# Altium schematic sheet Control.SchDoc
size A4
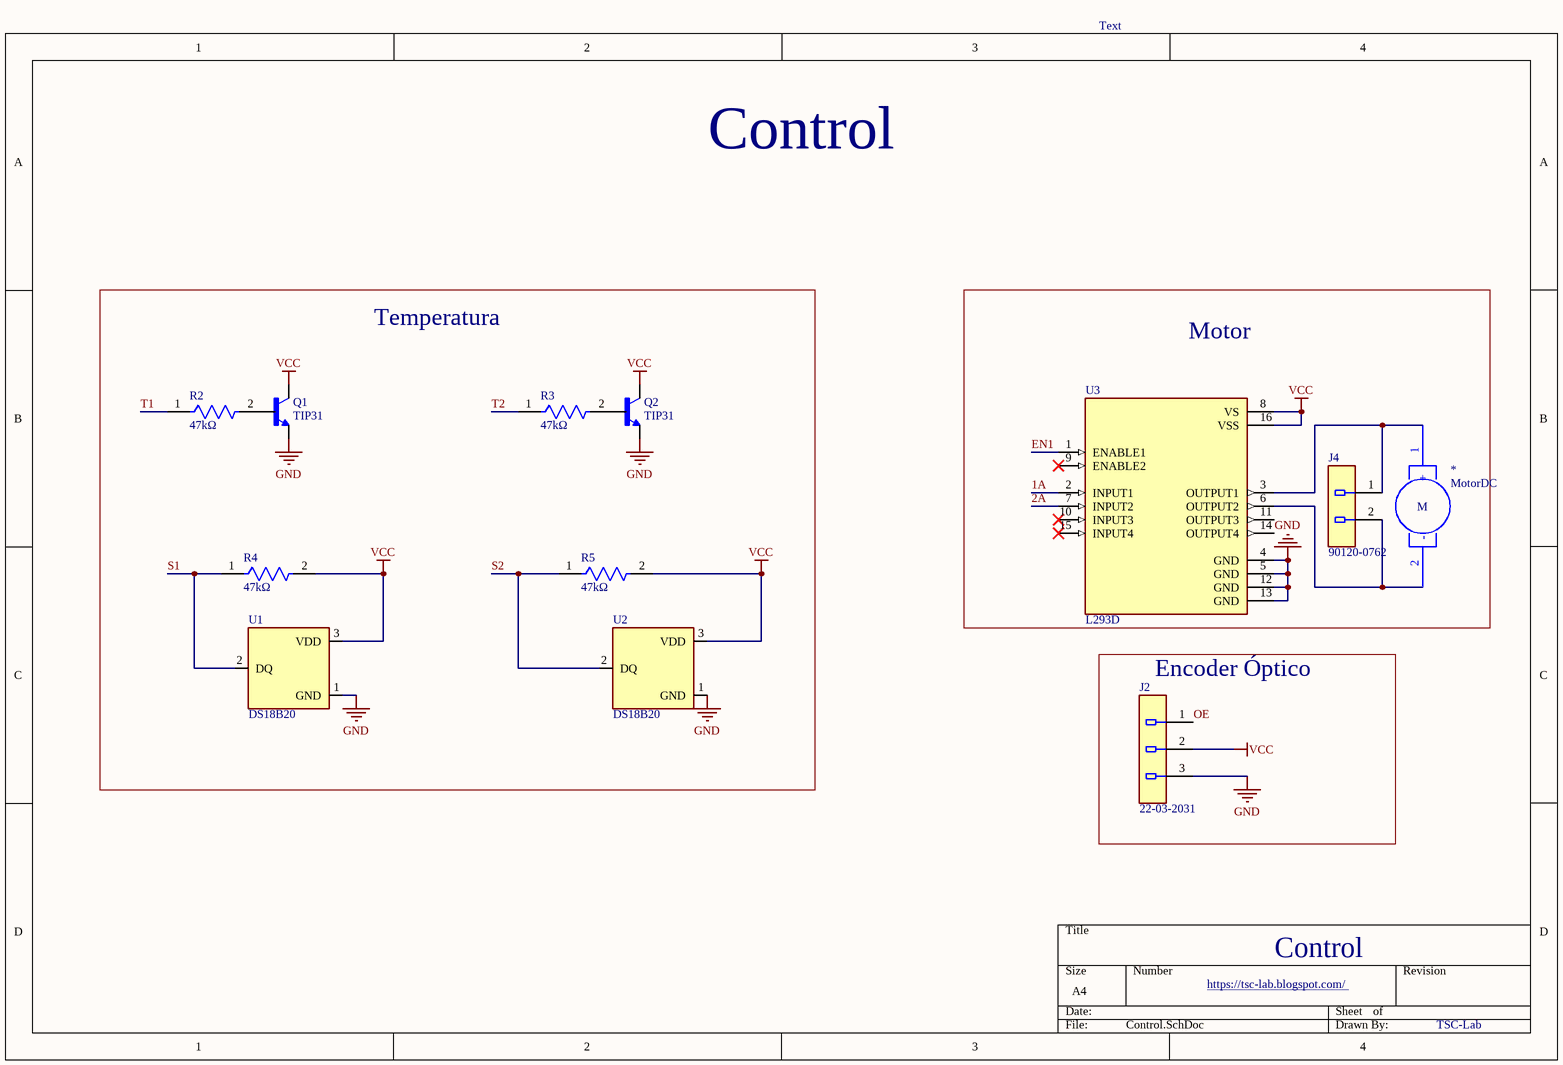
[diagram p0: Control.SchDoc]

## Parts
*  MotorDC  [PCBComponent_1]
J2  Part Number: 22-03-2031  [Molex_SD-4030-0001_0]  (hidden comment: Conn_Molex_22-03-2031_eec)
J4  Part Number: 90120-0762  [Molex_90120-0762_0]  (hidden comment: Conn_Molex_90120-0762_eec)
Q1  TIP31  [TO254P1060X482X2222-3]
Q2  TIP31  [TO254P1060X482X2222-3]
R2  Resistance: 47kΩ  [Vishay_SFR2500002200FR500_0]  (hidden comment: Res_Vishay_SFR2500002200FR500_eec)
R3  Resistance: 47kΩ  [Vishay_SFR2500002200FR500_0]  (hidden comment: Res_Vishay_SFR2500002200FR500_eec)
R4  Resistance: 47kΩ  [Vishay_SFR2500002200FR500_0]  (hidden comment: Res_Vishay_SFR2500002200FR500_eec)
R5  Resistance: 47kΩ  [Vishay_SFR2500002200FR500_0]  (hidden comment: Res_Vishay_SFR2500002200FR500_eec)
U1  DS18B20  [TO-92-TO92127P495H2044-3]
U2  DS18B20  [TO-92-TO92127P495H2044-3]
U3  L293D  [DIP880W50P254L2000H510Q16]

## Blocks framed on the sheet
Temperatura: Q1 Q2 R2-R5 U1 U2
Motor: * J4 U3
Encoder Óptico: J2

## Nets
GND: J2.3 Q1.3(E) Q2.3(E) U1.1(GND) U2.1(GND) U3.4(GND) U3.5(GND) U3.12(GND) U3.13(GND)
VCC: J2.2 Q1.2(C) Q2.2(C) R4.2 R5.2 U1.3(VDD) U2.3(VDD) U3.8(VS) U3.16(VSS)
1A: U3.2(INPUT1)
2A: U3.7(INPUT2)
EN1: U3.1(ENABLE1)
OE: J2.1
S1: R4.1 U1.2(DQ)
S2: R5.1 U2.2(DQ)
T1: R2.1
T2: R3.1
Net*_1: *.1(+) J4.1 U3.3(OUTPUT1)
Net*_2: *.2(-) J4.2 U3.6(OUTPUT2)
NetQ1_1: Q1.1(B) R2.2
NetQ2_1: Q2.1(B) R3.2

Not connected (* = marked no-connect by the designer): U3 9(ENABLE2)* 10(INPUT3)* 11(OUTPUT3) 14(OUTPUT4) 15(INPUT4)*

## Notes on the sheet
- Text
- Control
- https://tsc-lab.blogspot.com/ <https://tsc-lab.blogspot.com/ >
- TSC-Lab
- (in symbol MotorDC) M

## Library data of the parts
J2 = Conn_Molex_22-03-2031_eec: CONN HEADER 3POS .100 VERT TIN; Manufacturer: Molex; Voltage: 150V; Circuits_Loaded: 3; Current___Maximum_per_Contact: 4.0A; Mfg Package Ident: SD-4030-0001; helpURL: https://upverter.com/upn/revision/895d404c69e3c851/; ComponentLink2Description: Datasheet; Temperature: -40°C to +80°C; Package: SD-4030-0001; Supplier 2: Mouser; Price: 0.17996592642; Supplier 1: Digi-Key; ComponentLink1URL: https://upverter.com/upn/revision/895d404c69e3c851/; Supplier Part Number 2: 538-22-03-2031; Supplier Part Number 1: WM4001-ND; ComponentLink1Description: Upverter; ComponentLink2URL: http://www.molex.com/pdm_docs/sd/022032031_sd.pdf; RoHS: TRUE; Mouser Part Number: 538-22-03-2031; Temperature Range High: +80°C; Flammability: 94V-0; Digikey Description: CONN HEADER 3POS .100 VERT TIN; Digikey Part Number: WM4001-ND; Type: connector; Lead Free: yes; Temperature Range Low: -40°C; Num Pins: 3
J4 = Conn_Molex_90120-0762_eec: CONN HEADER 2POS .100" STR GOLD; Manufacturer: Molex; helpURL: https://upverter.com/upn/revision/2e8a16f42ccfe3ab/; ComponentLink2Description: Datasheet; Temperature: -55°C to +125°C; Package: CONN_PTH_HDR2; Supplier 2: Mouser; Supplier 1: Digi-Key; ComponentLink1URL: https://upverter.com/upn/revision/2e8a16f42ccfe3ab/; Supplier Part Number 2: 538-90120-0762; Supplier Part Number 1: WM8084-ND; ComponentLink1Description: Upverter; ComponentLink2URL: http://www.molex.com/pdm_docs/sd/901200761_sd.pdf; RoHS: TRUE; Mouser Part Number: 538-90120-0762; Temperature Range High: +125°C; Digikey Description: CONN HEADER 2POS .100" STR GOLD; Digikey Part Number: WM8084-ND; Temperature Range Low: -55°C; Lead Free: yes
Q1 Q2 = TIP31: Bipolar (BJT) Transistor NPN 40V 3A 3MHz 2W Through Hole TO-220AB; MF: {'manufacturer': u'ON Semiconductor'}; Price: None; Availability: Unavailable; MP: TIP31; Value: *; Package: None
R2-R5 = Res_Vishay_SFR2500002200FR500_eec: RES 220 OHM 0.4W 1% AXIAL; Manufacturer: Vishay; Voltage: 250 V; Value: 220Ω; power_rating: 400 mW; Category 7542B8484461Ae85: Passive Components; Category 5A00970A6D5C81C7: Uncategorized; Category 5C6A91606D4187Ad: Resistors; Power: 400mW; Category Cd01000Bfc2916C6: Single Components; Symbol 0 0: Resistor; Num Pins: 2; Part Number: SFR2500002200FR500; helpURL: https://upverter.com/upn/revision/077f2be647fd95a8/; ComponentLink2Description: Datasheet; Temperature: -55°C to +155°C; Package: AXIAL; Supplier 2: Mouser; Price: 0.0503066408853; Supplier 1: Digi-Key; ComponentLink1URL: https://upverter.com/upn/revision/077f2be647fd95a8/; Supplier Part Number 2: 594-5043ED220R0F; Supplier Part Number 1: PPC220YCT-ND; ComponentLink1Description: Upverter; ComponentLink2URL: http://www.vishay.com/docs/28722/sfr16s25.pdf; RoHS: TRUE; Mouser Part Number: 594-5043ED220R0F; Operating temperature range: -55 °C to 155 °C; voltage_rating_dc: 250 V; Ipc Land Pattern Name: RESAD1076W80L750D250; Tolerance: 1%; Temperature Range High: +155°C; Octopart Part Number: d6c31f7a8f400904; Digikey Description: RES 220 OHM 0.4W 1% AXIAL; Digikey Part Number: PPC220YCT-ND; Type: resistor; Lead Free: yes; Temperature Range Low: -55°C
U1 U2 = DS18B20: digital thermometer -55C-125C TO92-3; MF: {'manufacturer': u'Maxim Integrated'}; Value: *; MP: DS18B20; Availability: Unavailable; Price: None; Package: None
U3 = L293D: 4-Channel Motor Driver 24V 16-Pin Power PDIP Tube; MF: {'manufacturer': u'STMicroelectronics'}; Availability: Unavailable; MP: L293D; Price: None; Value: *; Package: None